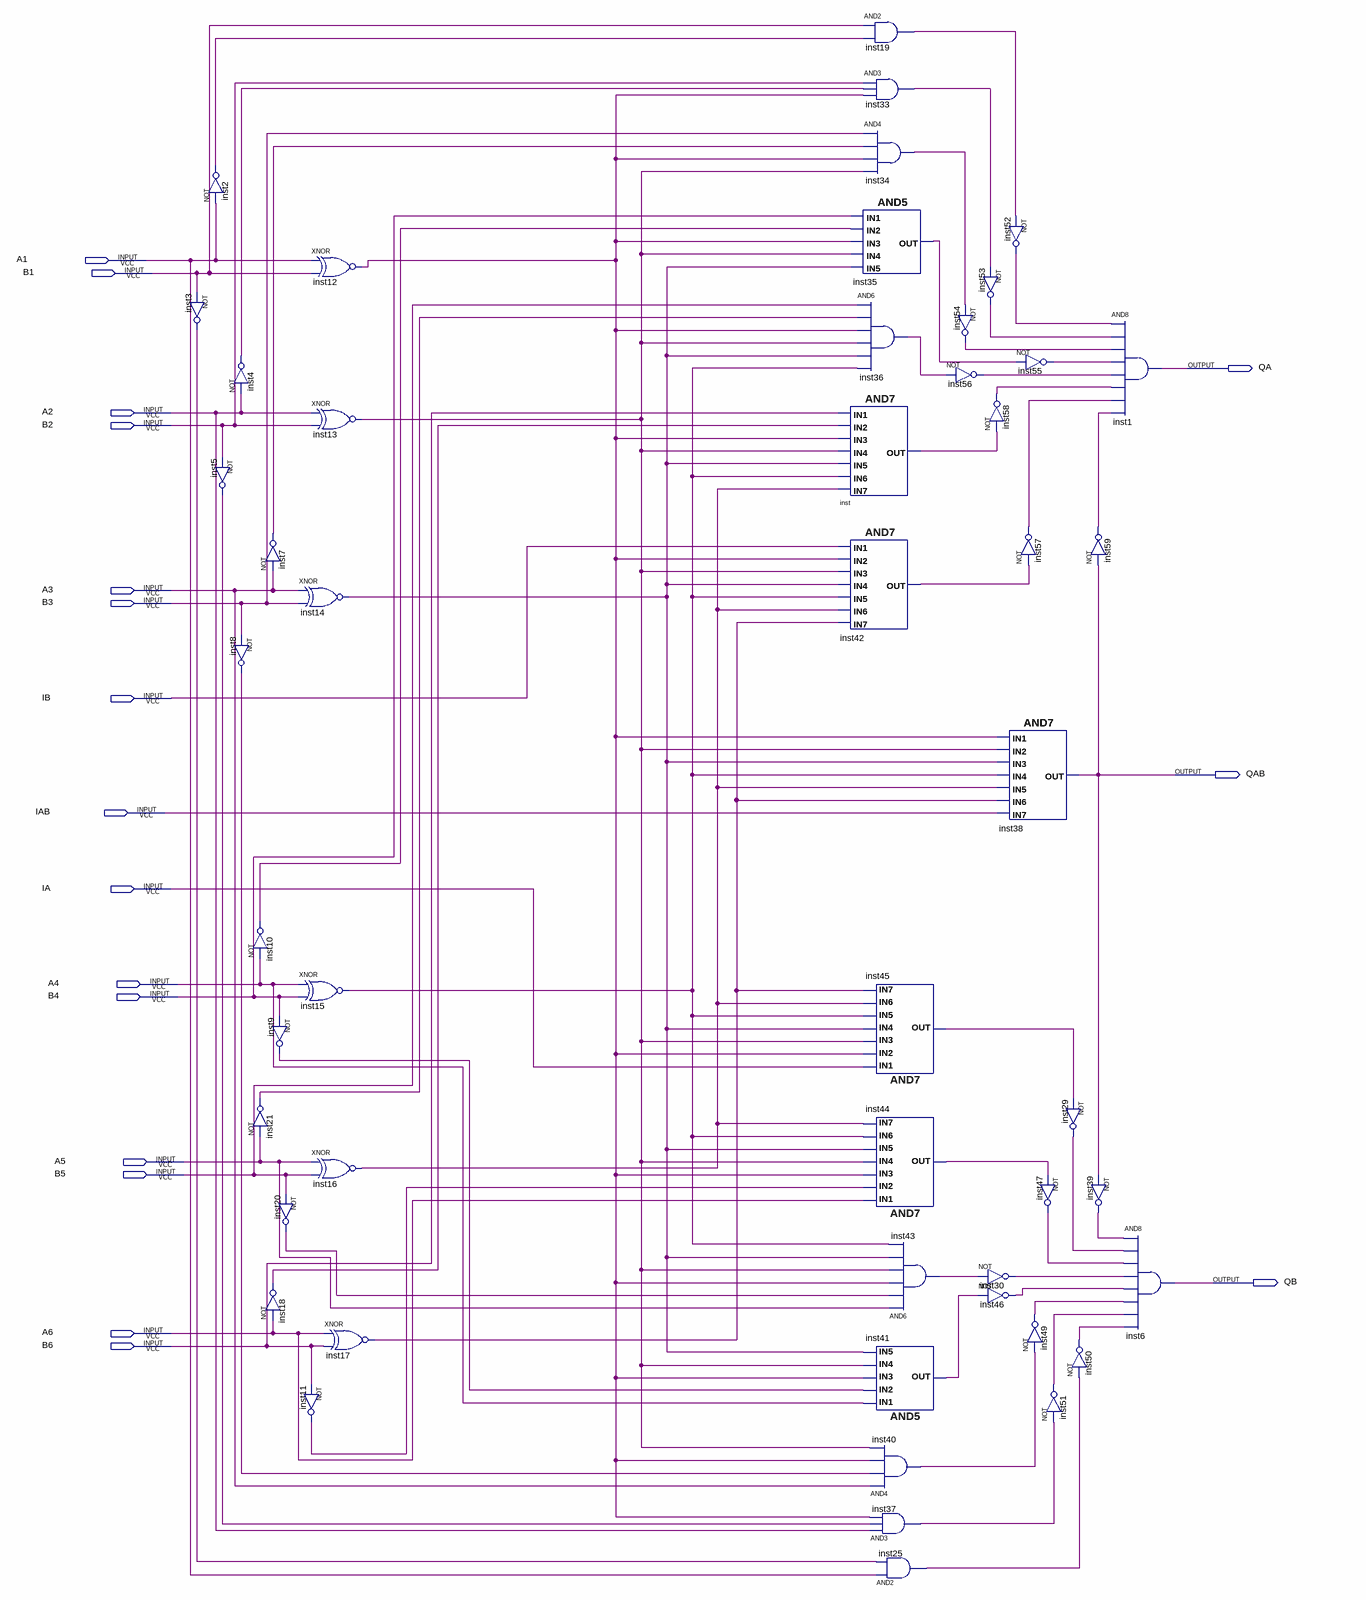
[diagram p0: schematic sheet]
// Quartus schematic COMPARADOR_6bits.bdf as structural Verilog: 51 symbols, 18 pins
module COMPARADOR_6bits (
  input  A1,
  input  B1,
  input  A2,
  input  B2,
  input  A3,
  input  B3,
  input  IB,
  input  IAB,
  input  IA,
  input  A4,
  input  B4,
  input  A5,
  input  B5,
  input  A6,
  input  B6,
  output QA,
  output QAB,
  output QB
);

  wire inst2_out, inst3_out, inst4_out, inst5_out, inst7_out, inst8_out, inst9_out, inst10_out, inst11_out,
       inst12_out, inst13_out, inst14_out, inst15_out, inst16_out, inst17_out, inst18_out, inst19_out,
       inst20_out, inst21_out, inst25_out, inst29_out, inst30_out, inst33_out, inst34_out, inst35_out,
       inst36_out, inst37_out, inst39_out, inst40_out, inst41_out, inst42_out, inst43_out, inst44_out,
       inst45_out, inst46_out, inst47_out, inst49_out, inst50_out, inst51_out, inst52_out, inst53_out,
       inst54_out, inst55_out, inst56_out, inst57_out, inst58_out, inst59_out, inst_out;

  not inst3 (inst3_out, B1);
  not inst2 (inst2_out, A1);
  not inst4 (inst4_out, A2);
  not inst5 (inst5_out, B2);
  not inst8 (inst8_out, B3);
  not inst10 (inst10_out, A4);
  not inst21 (inst21_out, A5);
  not inst7 (inst7_out, A3);
  xnor inst14 (inst14_out, A3, B3);
  xnor inst15 (inst15_out, A4, B4);
  not inst9 (inst9_out, B4);
  not inst20 (inst20_out, B5);
  not inst18 (inst18_out, A6);
  not inst11 (inst11_out, B6);
  xnor inst12 (inst12_out, A1, B1);
  xnor inst13 (inst13_out, A2, B2);
  xnor inst16 (inst16_out, A5, B5);
  xnor inst17 (inst17_out, A6, B6);
  and inst35 (inst35_out, B4, inst10_out, inst12_out, inst13_out, inst14_out);
  and inst36 (inst36_out, B5, inst21_out, inst12_out, inst13_out, inst14_out, inst15_out);
  and inst (inst_out, B6, inst18_out, inst12_out, inst13_out, inst14_out, inst15_out, inst16_out);
  and inst42 (inst42_out, IB, inst12_out, inst13_out, inst14_out, inst15_out, inst16_out, inst17_out);
  and inst19 (inst19_out, B1, inst2_out);
  and inst33 (inst33_out, B2, inst4_out, inst12_out);
  and inst34 (inst34_out, B3, inst7_out, inst12_out, inst13_out);
  and inst45 (inst45_out, IA, inst12_out, inst13_out, inst14_out, inst15_out, inst16_out, inst17_out);
  and inst44 (inst44_out, A6, inst11_out, inst12_out, inst13_out, inst14_out, inst15_out, inst16_out);
  and inst43 (inst43_out, A5, inst20_out, inst12_out, inst13_out, inst14_out, inst15_out);
  and inst41 (inst41_out, A4, inst9_out, inst12_out, inst13_out, inst14_out);
  and inst40 (inst40_out, A3, inst8_out, inst12_out, inst13_out);
  and inst37 (inst37_out, A2, inst5_out, inst12_out);
  and inst25 (inst25_out, A1, inst3_out);
  not inst54 (inst54_out, inst34_out);
  not inst56 (inst56_out, inst36_out);
  not inst52 (inst52_out, inst19_out);
  not inst53 (inst53_out, inst33_out);
  not inst58 (inst58_out, inst_out);
  and inst38 (QAB, inst12_out, inst13_out, inst14_out, inst15_out, inst16_out, inst17_out, IAB);
  not inst30 (inst30_out, inst43_out);
  not inst46 (inst46_out, inst41_out);
  not inst55 (inst55_out, inst35_out);
  not inst57 (inst57_out, inst42_out);
  not inst29 (inst29_out, inst45_out);
  not inst47 (inst47_out, inst44_out);
  not inst49 (inst49_out, inst40_out);
  not inst51 (inst51_out, inst37_out);
  and inst1 (QA, inst52_out, inst53_out, inst54_out, inst55_out, inst56_out, inst58_out, inst57_out, inst59_out);
  not inst59 (inst59_out, QAB);
  not inst39 (inst39_out, QAB);
  not inst50 (inst50_out, inst25_out);
  and inst6 (QB, inst39_out, inst29_out, inst47_out, inst30_out, inst46_out, inst49_out, inst51_out, inst50_out);
endmodule
